# EAGLE design USBasp (EAGLE 6.5.0)
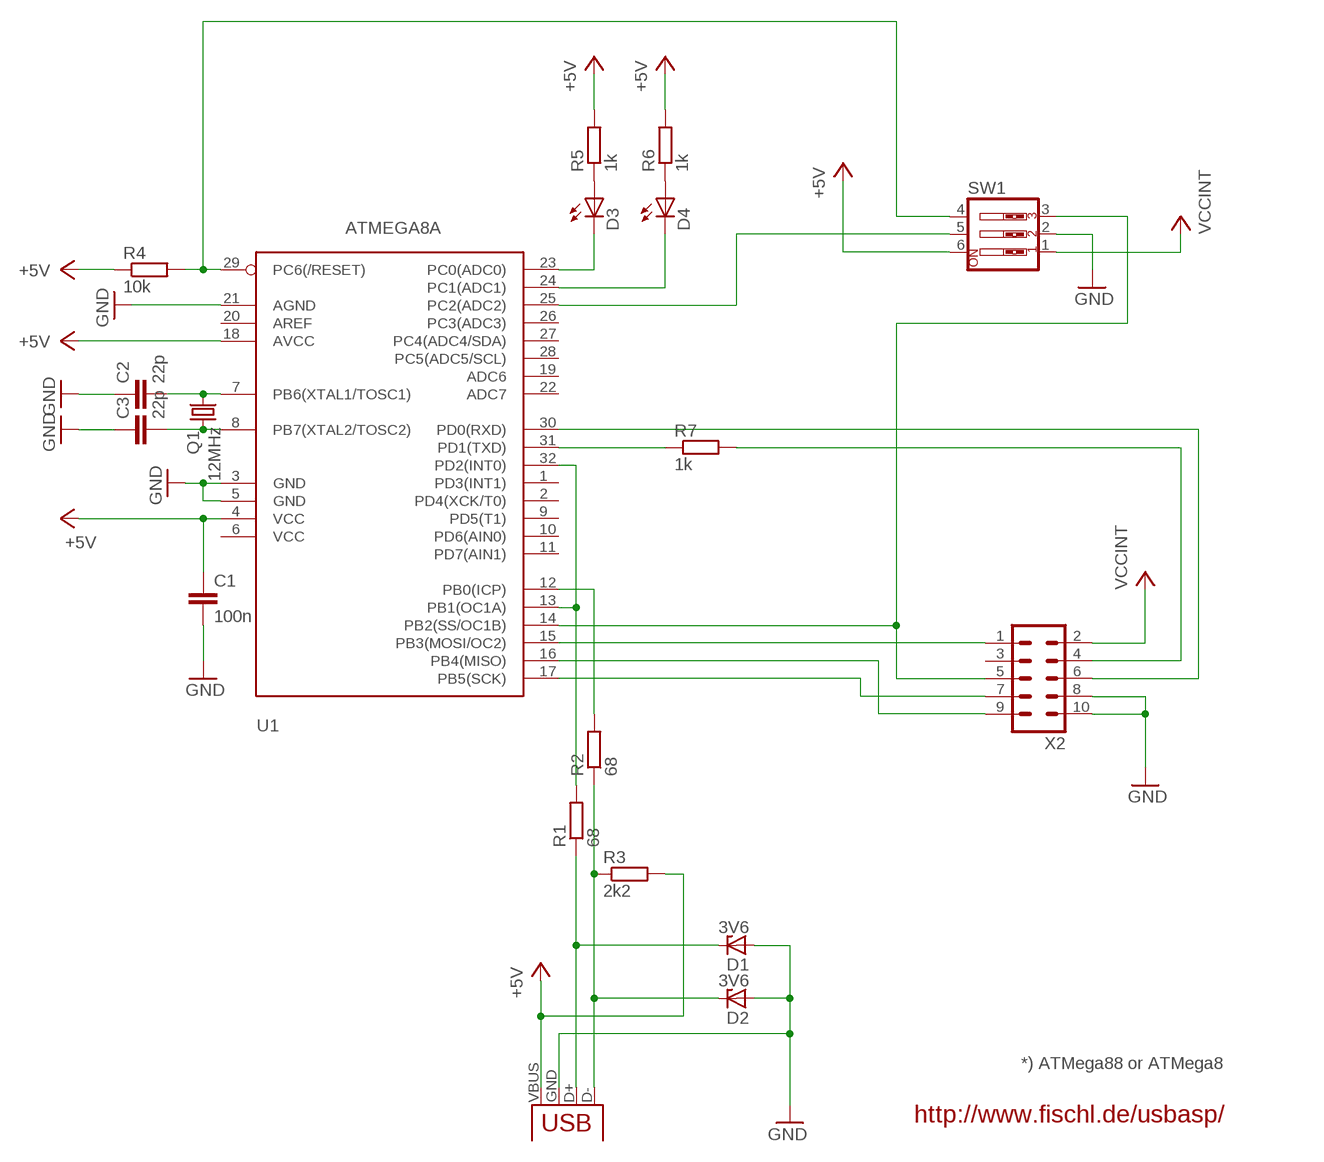
[diagram p0: schematic, sheet 1]

## Parts
C1  100n  C-EUC0805  [C0805]
C2  22p  C-EUC0805  [C0805]
C3  22p  C-EUC0805  [C0805]
D1  3V6  ZENER-DIODESOD80C  [SOD80C]
D2  3V6  ZENER-DIODESOD80C  [SOD80C]
D3  LEDCHIPLED_0805  [CHIPLED_0805]
D4  LEDCHIPLED_0805  [CHIPLED_0805]
Q1  12MHz  CRYTALHC49S  [HC49/S]
R1  68  R-EU_R0805  [R0805]
R2  68  R-EU_R0805  [R0805]
R3  2k2  R-EU_R0805  [R0805]
R4  10k  R-EU_R0805  [R0805]
R5  1k  R-EU_R0805  [R0805]
R6  1k  R-EU_R0805  [R0805]
R7  1k  R-EU_R0805  [R0805]
SW1  SW_DIP-3  [EDG-03]
U1  ATMEGA8A  AVR-MEGA8-AI  [TQFP32-08]
X1  USB-A-H  [USB-A-H]
X2  ML10L  [ML10L]

## Nets
+5V: C1.1 R3.2 R4.1 R5.2 R6.2 SW1.6 U1.4(VCC) U1.18(AVCC) X1.VBUS(GND)
GND: C1.2 C2.1 C3.1 D1.A D2.A SW1.2 U1.3(GND) U1.5(GND) U1.21(AGND) X1.GND(VBUS) X2.8 X2.10
N$1: R4.2 SW1.4 U1.29(PC6(/RESET))
N$2: SW1.3 U1.14(PB2(SS/OC1B)) X2.5
N$3: U1.15(PB3(MOSI/OC2)) X2.1
N$4: U1.17(PB5(SCK)) X2.7
N$5: D2.C R2.1 R3.1 X1.D-(D+)
N$6: U1.16(PB4(MISO)) X2.9
N$7: R1.2 U1.13(PB1(OC1A)) U1.32(PD2(INT0))
N$8: D1.C R1.1 X1.D+(D-)
N$9: R7.1 U1.31(PD1(TXD))
N$10: R7.2 X2.4
N$11: U1.30(PD0(RXD)) X2.6
N$12: SW1.5 U1.25(PC2(ADC2))
N$13: D3.A R5.1
N$14: D3.C U1.23(PC0(ADC0))
N$15: D4.C U1.24(PC1(ADC1))
N$16: R2.2 U1.12(PB0(ICP))
N$17: D4.A R6.1
N$22: C2.2 Q1.2 U1.7(PB6(XTAL1/TOSC1))
N$23: C3.2 Q1.1 U1.8(PB7(XTAL2/TOSC2))
VCCINT: SW1.1 X2.2
Unconnected: U1.1(PD3(INT1)) U1.2(PD4(XCK/T0)) U1.6(VCC) U1.9(PD5(T1)) U1.10(PD6(AIN0)) U1.11(PD7(AIN1)) U1.19(ADC6) U1.20(AREF) U1.22(ADC7) U1.26(PC3(ADC3)) U1.27(PC4(ADC4/SDA)) U1.28(PC5(ADC5/SCL)) X2.3

## Notes on the sheet
- *) ATMega88 or ATMega8
- http://www.fischl.de/usbasp/

## Library data of the parts
C1-C3 = rcl:C-EU: CAPACITOR, European symbol
D1 D2 = diode:ZENER-DIODE: Z-Diode
D3 D4 = led:LED: LED OSRAM: - CHIPLED LG R971, LG N971, LY N971, LG Q971, LY Q971, LO R971, LY R971 LH N974, LH R974 LS Q976, LO Q976, LY Q976 LO Q996 - Hyper CHIPLED LW Q18S LB Q993, LB Q99A, LB R99A - SideLED LS A670, LO A670, LY A670, LG A670, LP A670 LB A673, LV A673, LT A673, LW A673 LH A674 LY A675 LS A676, LA A676, LO A676, LY A676, LW A676 LS A679, LY A679, LG A679 - Hyper Micro SIDELED® LS Y876, LA Y876, LO Y876, LY Y876 LT Y87S - SmartLED LW L88C, LW L88S LB L89C, LB L89S, LG L890 LS L89K, LO L89K, LY L89K LS L896, LA L896, LO L896, LY L896 - TOPLED LS T670, LO T670, LY T670, LG T670, LP T670 LSG T670, LSP T670, LSY T670, LOP T670, LYG T670 LG T671, LOG T671, LSG T671 LB T673, LV T673, LT T673, LW T673 LH T674 LS T676, LA T676, LO T676, LY T676, LB T676, LH T676, LSB T676, LW T676 LB T67C, LV T67C, LT T67C, LS T67K, LO T67K, LY T67K, LW E67C LS E67B, LA E67B, LO E67B, LY E67B, LB E67C, LV E67C, LT E67C LW T67C LS T679, LY T679, LG T679 LS T770, LO T770, LY T770, LG T770, LP T770 LB T773, LV T773, LT T773, LW T773 LH T774 LS E675, LA E675, LY E675, LS T675 LS T776, LA T776, LO T776, LY T776, LB T776 LHGB T686 LT T68C, LB T68C - Hyper Mini TOPLED® LB M676 - Mini TOPLED Santana® LG M470 LS M47K, LO M47K, LY M47K Source: http://www.osram.convergy.de LUXEON: - LUMILED® LXK2-PW12-R00, LXK2-PW12-S00, LXK2-PW14-U00, LXK2-PW14-V00 LXK2-PM12-R00, LXK2-PM12-S00, LXK2-PM14-U00 LXK2-PE12-Q00, LXK2-PE12-R00, LXK2-PE12-S00, LXK2-PE14-T00, LXK2-PE14-U00 LXK2-PB12-K00, LXK2-PB12-L00, LXK2-PB12-M00, LXK2-PB14-N00, LXK2-PB14-P00, LXK2-PB14-Q00 LXK2-PR12-L00, LXK2-PR12-M00, LXK2-PR14-Q00, LXK2-PR14-R00 LXK2-PD12-Q00, LXK2-PD12-R00, LXK2-PD12-S00 LXK2-PH12-R00, LXK2-PH12-S00 LXK2-PL12-P00, LXK2-PL12-Q00, LXK2-PL12-R00 Source: www.luxeon.com KINGBRIGHT: KA-3528ASYC Source: www.kingbright.com
Q1 = crystal:CRYTAL: CRYSTAL
R1-R7 = resistor:R-EU_: RESISTOR, European symbol
SW1 = special:SW_DIP-3: DIP SWITCH
U1 = SparkFun-DigitalIC:AVR-MEGA8: MICROCONTROLLER 8 Kbytes FLASH 1 kbytes SRAM 512 bytes EEPROM USART 6-channel 10 bit ADC 2-channel 8 bit ADC
X1 = SparkFun-Connectors:USB: USB Connectors USB-B-PTH is fully proven SKU : PRT-00139/CONN-08278 USB-miniB is fully proven SKU : PRT-00587 USB-A-PCB is untested. USB-A-H is throughly reviewed, but untested. Spark Fun Electronics SKU : PRT-00437 USB-B-SMT is throughly reviewed, but untested. Needs silkscreen touching up. USB-A-S has not been used/tested USB-MB-H has not been used/tested USB-MICROB has been used. CONN-09505
X2 = con-harting-ml:ML10: HARTING

## Board
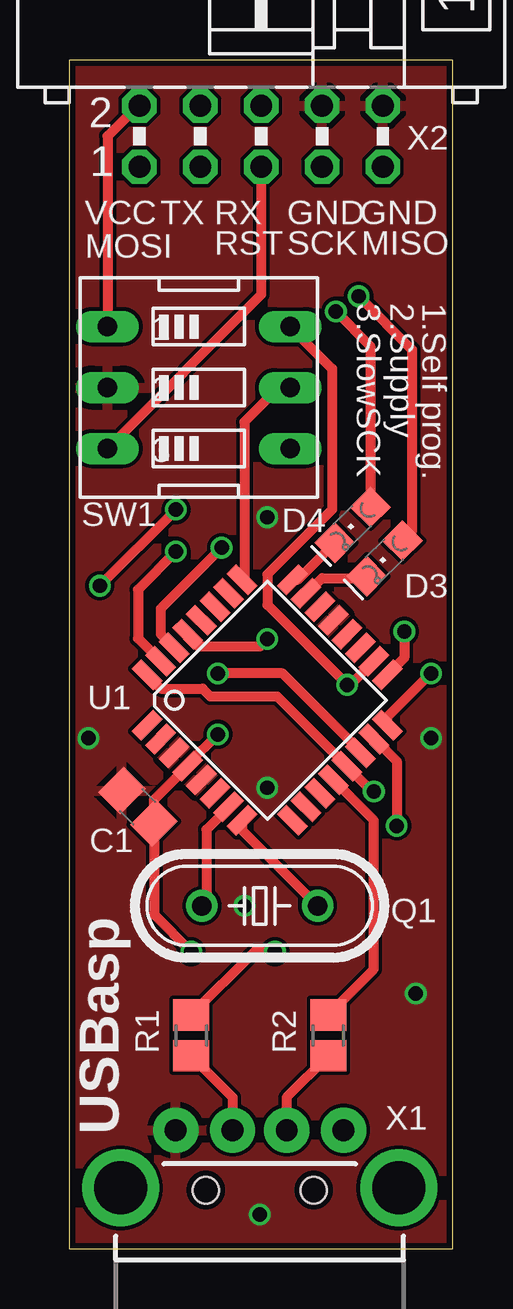
[diagram p1: board, top side]
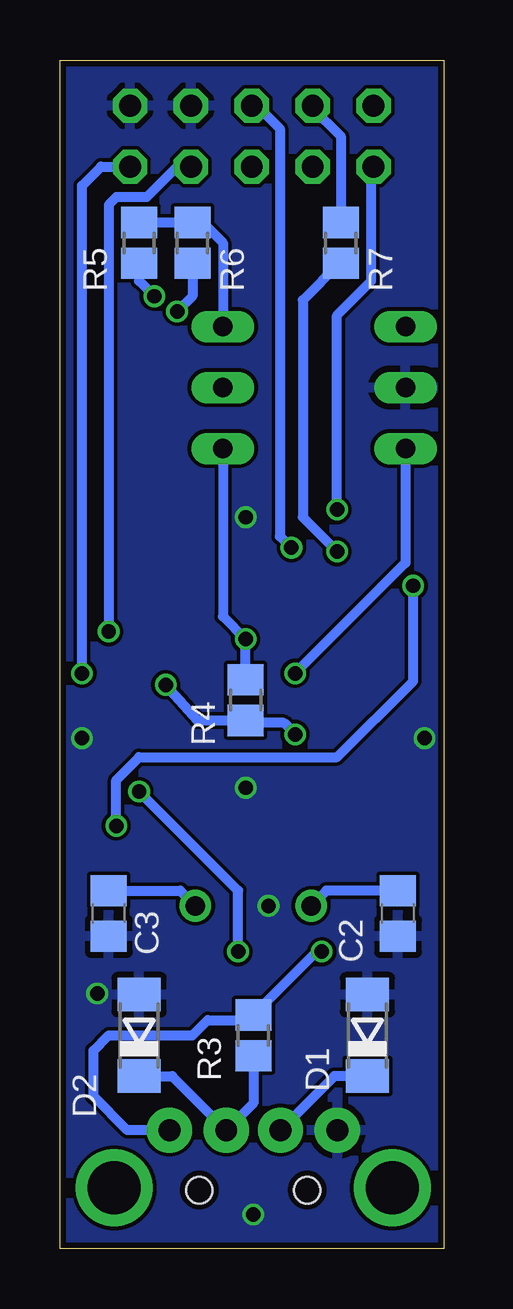
[diagram p2: board, bottom side, seen from below]

Size 16 x 49.53 mm. Coordinates in mm from the lower left corner, seen from the top.
Outline: 0,0 16,0 16,49.53 0,49.53 0,0
Copper layers (1*16): Top 0.035mm / dielectric 1.5mm / Bottom 0.035mm
Design rules "ITEADstudio_DRC": minimum track width 6mil, minimum drill 12mil, track to track 6mil, track to pad 6mil, pad to pad 6mil, via to via 6mil, smd to smd 0mil, copper to edge 10mil, drill to drill 10mil, minimum pad ring 10mil, minimum via ring 6mil, stop-mask expansion 2mil, vias tented up to drill 100mil, thermal gap 10mil

### Footprints (pad centres in the part's own frame; a part is rotated, then mirrored left to right if it is on the bottom)
C0805 = smd 1.3 x 1.5: 1 -0.95,0; 2 0.95,0
SOD80C = smd 1.4 x 1.8: A 1.7,0; C -1.7,0
CHIPLED_0805 = smd 1.2 x 1.2: A 0,-1.05; C 0,1.05
HC49/S = drill 0.813: 1 -2.413,0; 2 2.413,0
R0805 = smd 1.3 x 1.5: 1 -0.85,0; 2 0.85,0
EDG-03 = drill 0.813 long: 1 -2.54,-3.81; 2 0,-3.81; 3 2.54,-3.81; 4 2.54,3.81; 5 0,3.81; 6 -2.54,3.81
TQFP32-08 = smd 1.27 x 0.559: 1 -4.293,2.8; 2 -4.293,2; 3 -4.293,1.2; 4 -4.293,0.4; 5 -4.293,-0.4; 6 -4.293,-1.2; 7 -4.293,-2; 8 -4.293,-2.8; 17 4.293,-2.8; 18 4.293,-2; 19 4.293,-1.2; 20 4.293,-0.4; 21 4.293,0.4; 22 4.293,1.2; 23 4.293,2; 24 4.293,2.8 | smd 0.559 x 1.27: 9 -2.8,-4.293; 10 -2,-4.293; 11 -1.2,-4.293; 12 -0.4,-4.293; 13 0.4,-4.293; 14 1.2,-4.293; 15 2,-4.293; 16 2.8,-4.293; 25 2.8,4.293; 26 2,4.293; 27 1.2,4.293; 28 0.4,4.293; 29 -0.4,4.293; 30 -1.2,4.293; 31 -2,4.293; 32 -2.8,4.293
USB-A-H = drill 0.914 pad 1.88: D+ 2.4,1.127; D- 2.4,-1.127; GND 2.4,3.5; VBUS 2.4,-3.5 | drill 2.2: GND2 0,-5.8; GND3 0,5.8 | hole 1.1: -0.1,2.25; -0.1,-2.25
ML10L = drill 0.914 octagon: 1 -5.08,-1.27; 2 -5.08,1.27; 3 -2.54,-1.27; 4 -2.54,1.27; 5 0,-1.27; 6 0,1.27; 7 2.54,-1.27; 8 2.54,1.27; 9 5.08,-1.27; 10 5.08,1.27

### Placement (x,y rotation side)
C1  2.86,18.41 135 top
C2  1.91,13.97 90 bottom
C3  13.97,13.97 90 bottom
D1  3.17,8.89 90 bottom
D2  12.7,8.89 90 bottom
D3  13.14,28.77 135 top
D4  11.81,30.16 135 top
Q1  7.94,14.29 180 top
R1  5.08,8.89 90 top
R2  10.79,8.89 90 top
R3  7.94,8.89 90 bottom
R4  8.26,22.86 90 bottom
R5  12.7,41.91 90 bottom
R6  10.48,41.91 90 bottom
R7  4.29,41.91 90 bottom
SW1  5.4,35.88 270 top
U1  8.26,22.86 45 top
X1  7.94,2.54 90 top
X2  8,46.35 0 top

### Tracks (layer width: path | path; a pad name or v marks a point on that pad's centre or on a via)
+5V  (via drill 0.6)
  Top 0.406: U1.18 11.65,23.43 | 11.65,23.43 11.59,23.52 v11.59,23.5 | v6.19,21.43 4.94,20.18 U1.4 3.53,18.7 C1.1 3.53,13.93 v5.08,12.38 | v11.59,23.5 8.26,26.83 8.26,28.1 10.95,30.8 10.95,36.67 SW1.6 8.99,38.63 | v11.59,23.5 11.65,23.43
  Bottom 0.406: v11.59,23.5 10.26,22.01 R4.1 8.15,21.91 6.67,21.91 v6.19,21.43 | R5.2 R6.2 10.06,42.76 9.21,41.91 SW1.6 | X1.VBUS 13.2,4.94 14.61,6.35 14.61,8.26 13.97,8.89 10.48,8.89 9.84,9.53 8.15,9.53 R3.2 5.29,12.38 v5.08,12.38
GND  (via drill 0.6)
  other vias: 14.45,10.64 8.26,19.21 0.79,21.27 7.3,14.29 7.94,1.43 8.26,30.48 15.08,21.27
  pour Bottom: 0,0 16,0 16,49.53 0,49.53
  pour Top: 0,0 16,0 16,49.53 0,49.53
N$1  (via drill 0.6)
  Top 0.406: v8.26,25.4 7.94,25.08 5.4,25.08 4.94,25.54 U1.29
  Bottom 0.406: R4.2 v8.26,25.4 9.21,26.35 SW1.4
N$2  (via drill 0.6)
  Top 0.406: U1.14 12.14,20.72 8.89,23.97 v6.19,23.97 | X2.5 8,39.75 SW1.3
  Bottom 0.406: v6.19,23.97 1.59,28.57 SW1.3
N$3  (via drill 0.6)
  Top 0.406: U1.15 12.73,21.24 13.65,20.32 v13.65,17.62 | v1.27,27.62 v4.45,30.8
  Bottom 0.406: v13.65,17.62 13.65,19.53 12.7,20.48 4.45,20.48 1.27,23.65 v1.27,27.62 | v4.45,30.8 4.45,38.89 3.02,40.32 3.02,44.99 X2.1
N$4  (via drill 0.6)
  Top 0.406: v13.97,25.72 13.97,24.61 U1.17
  Bottom 0.406: X2.7 11.11,45.09 12.38,43.81 13.65,43.81 13.97,43.5 v13.97,25.72
N$5
  Top 0.406: R2.1 9.06,6.31 X1.D-
  Bottom 0.406: D2.C 11.31,7.19 X1.D- 7.94,6.07 R3.1
N$6  (via drill 0.6)
  Top 0.406: U1.16 13.27,22.16 v15.08,23.97
  Bottom 0.406: v15.08,23.97 15.08,44.29 14.29,45.09 X2.9
N$7  (via drill 0.6)
  Top 0.406: U1.13 12.63,19.05 v12.7,19.05 | 11.57,20.18 U1.13 | U1.32 3.24,23.91 3.81,23.34 5.56,23.34 5.87,23.02 8.66,23.02 U1.13 | 11.2,20.48 U1.13 | R1.2 7.72,12.38 v8.57,12.38
  Bottom 0.406: v8.57,12.38 8.57,14.92 v12.7,19.05
N$8
  Top 0.406: R1.1 6.81,6.31 X1.D+
  Bottom 0.406: D1.C 4.56,7.19 X1.D+
N$9  (via drill 0.6)
  Top 0.406: v4.45,29.05 2.86,27.46 2.86,25.43 U1.31
  Bottom 0.406: R7.1 4.34,41.06 5.87,39.53 5.87,30.48 v4.45,29.05
N$10
  Bottom 0.406: R7.2 4.29,46.35 5.46,47.53 X2.4
N$11  (via drill 0.6)
  Top 0.406: v6.35,29.21 3.81,26.67 3.81,25.61 U1.30
  Bottom 0.406: X2.6 7.78,47.62 6.83,46.67 6.83,29.69 v6.35,29.21
N$12
  Top 0.406: U1.25 7.3,27.98 7.3,34.45 8.57,35.72 9.05,35.72 SW1.5
N$13  (via drill 0.6)
  Top 0.406: v12.06,39.69 14.29,37.47 14.29,29.91 D3.A
  Bottom 0.406: R5.1 12.7,40.32 v12.06,39.69
N$14
  Top 0.406: U1.23 9.91,27.31 10.54,27.94 12.32,27.94 D3.C
N$15
  Top 0.406: U1.24 9.52,27.88 D4.C
N$16
  Top 0.406: U1.12 12.7,17.85 12.7,11.64 R2.2
N$17  (via drill 0.6)
  Top 0.406: v11.11,39.05 12.55,37.61 D4.A
  Bottom 0.406: R6.1 10.48,39.69 v11.11,39.05
N$22
  Top 0.406: U1.7 6.63,18.38 5.71,17.46 5.71,14.48 Q1.2
  Bottom 0.406: C2.2 4.89,14.92 Q1.2
N$23
  Top 0.406: U1.8 7.2,17.44 Q1.1
  Bottom 0.406: C3.2 10.98,14.92 Q1.1
VCCINT
  Top 0.406: SW1.1 1.59,46.35 2.86,47.62 X2.2

### Text on the board
_tsilk: VCC | TX | RX | GND | GND | MOSI | RST | SCK | MISO | 3.SlowSCK | 2.Supply | 1.Self prog. | 1 | 2 | 3 | USBasp